# Altium schematic sheet ATMEGA16.SchDoc
size A4
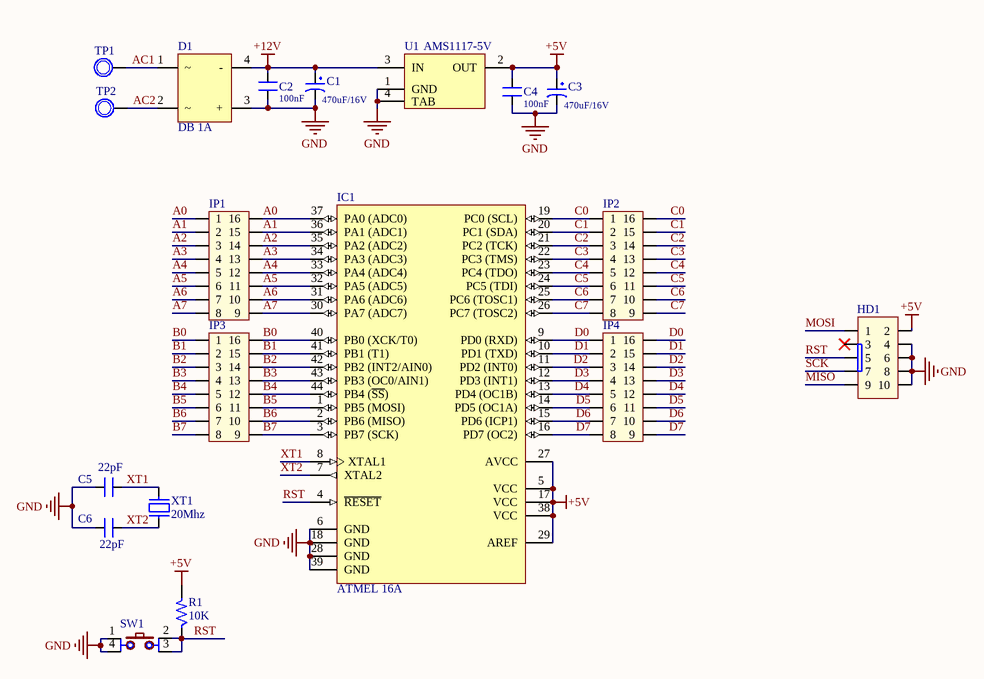
[diagram p0: ATMEGA16.SchDoc]

## Parts
C1  470uF/16V  [C-TANT-7343]
C2  100nF  [CER-0805]
C3  470uF/16V  [C-TANT-7343]
C4  100nF  [CER-0805]
C5  22pF  [CER-0805]
C6  22pF  [CER-0805]
D1  DB 1A  [D-DB-1A-SMD]
HD1  Header 5x2  [Hed2X5]  (value not drawn)
IC1  ATMEL 16A  [TQFP44]
IP1  JP8X2  [JP8X2]  (value not drawn)
IP2  JP8X2  [JP8X2]  (value not drawn)
IP3  JP8X2  [JP8X2]  (value not drawn)
IP4  JP8X2  [JP8X2]  (value not drawn)
R1  10K  [RES-0805]
SW1  SW  [SW2-SMD]  (value not drawn)
TP1  TP  [TP]  (value not drawn)
TP2  TP  [TP]  (value not drawn)
U1  AMS1117-5V  [LM1117]
XT1  20Mhz  [XTAL-RU49/4]

## Nets
+5V: C3.1 C4.2 HD1.2 IC1.5(VCC) IC1.17(VCC) IC1.27(AVCC) IC1.29(AREF) IC1.38(VCC) R1.2 U1.2(OUT)
+12V: C1.1 C2.2 D1.4(-) U1.3(IN)
GND: C1.2 C2.1 C3.2 C4.1 C5.1 C6.1 D1.3(+) HD1.4 HD1.6 HD1.8 HD1.10 IC1.6(GND) IC1.18(GND) IC1.28(GND) IC1.39(GND) SW1.1 SW1.4 U1.1(GND) U1.4(TAB)
A0: IC1.37(PA0_(ADC0)) IP1.1 IP1.16
A1: IC1.36(PA1_(ADC1)) IP1.2 IP1.15
A2: IC1.35(PA2_(ADC2)) IP1.3 IP1.14
A3: IC1.34(PA3_(ADC3)) IP1.4 IP1.13
A4: IC1.33(PA4_(ADC4)) IP1.5 IP1.12
A5: IC1.32(PA5_(ADC5)) IP1.6 IP1.11
A6: IC1.31(PA6_(ADC6)) IP1.7 IP1.10
A7: IC1.30(PA7_(ADC7)) IP1.8 IP1.9
AC1: D1.1 TP1.1
AC2: D1.2 TP2.1
B0: IC1.40(PB0_(XCK/T0)) IP3.1 IP3.16
B1: IC1.41(PB1_(T1)) IP3.2 IP3.15
B2: IC1.42(PB2_(INT2/AIN0)) IP3.3 IP3.14
B3: IC1.43(PB3_(OC0/AIN1)) IP3.4 IP3.13
B4: IC1.44(PB4_(~{SS})) IP3.5 IP3.12
B5: IC1.1(PB5_(MOSI)) IP3.6 IP3.11
B6: IC1.2(PB6_(MISO)) IP3.7 IP3.10
B7: IC1.3(PB7_(SCK)) IP3.8 IP3.9
C0: IC1.19(PC0_(SCL)) IP2.1 IP2.16
C1: IC1.20(PC1_(SDA)) IP2.2 IP2.15
C2: IC1.21(PC2_(TCK)) IP2.3 IP2.14
C3: IC1.22(PC3_(TMS)) IP2.4 IP2.13
C4: IC1.23(PC4_(TDO)) IP2.5 IP2.12
C5: IC1.24(PC5_(TDI)) IP2.6 IP2.11
C6: IC1.25(PC6_(TOSC1)) IP2.7 IP2.10
C7: IC1.26(PC7_(TOSC2)) IP2.8 IP2.9
D0: IC1.9(PD0_(RXD)) IP4.1 IP4.16
D1: IC1.10(PD1_(TXD)) IP4.2 IP4.15
D2: IC1.11(PD2_(INT0)) IP4.3 IP4.14
D3: IC1.12(PD3_(INT1)) IP4.4 IP4.13
D4: IC1.13(PD4_(OC1B)) IP4.5 IP4.12
D5: IC1.14(PD5_(OC1A)) IP4.6 IP4.11
D6: IC1.15(PD6_(ICP1)) IP4.7 IP4.10
D7: IC1.16(PD7_(OC2)) IP4.8 IP4.9
MISO: HD1.9
MOSI: HD1.1
RST: HD1.5 IC1.4(~{RESET}) R1.1 SW1.2 SW1.3
SCK: HD1.7
XT1: C5.2 IC1.8(XTAL1) XT1.2
XT2: C6.2 IC1.7(XTAL2) XT1.1

Not connected (* = marked no-connect by the designer): HD1 3*

## Library data of the parts
C1 C3 = Capacitor
C2 C4-C6 = Ceramic
D1 = DB
HD1 = HED5x2_S: Value: Header 5x2
IC1 = ATmega16A-AU: 8-bit AVR Microcontroller, 16KB Flash, 512 Bytes EEPROM, 1KB SRAM, 44-pin TQFP, Industrial Grade (-40°C to 85°C); Value: Atmega 16L
R1 = Res1/4W
SW1 = SW4: Switch button 4 pin; Value: Button chip 4 pin
U1 = LM1117IMP-3.3: 800mA Low-Dropout Linear Regulator; Manufacturer: National Semiconductor; CompType: LDO IC; PackageTopMarking: XYTT*N05B; PowerWise: N; Published: 4-Dec-2008; DatasheetVersion: Apr-2006; PackageVersion: revB, Apr-2003; PackageReference: MP04A; Publisher: Altium Limited; PackageDescription: Molded SOT-223, 6.50 x 3.56 x 1.6mm Body, 4 Lead, 2.3mm Pitch; PartNumber: LM1117IMP-3.3; RoHS: O; PinCount: 4; DigiKeyPartNumber: LM1117IMP-3.3CT-ND; Code_JEDEC: TO-261-AA; Code_IPC: SOT223-4; ComponentLink1Description: LM1117 Datasheet; ComponentLink1URL: http://www.national.com/ds/LM/LM1117.pdf; ComponentLink2Description: LM1117 Web Page; ComponentLink2URL: http://www.national.com/pf/LM/LM1117.html; ComponentLink3Description: MP04A Package Page; ComponentLink3URL: http://www.national.com/packaging/folders/mp04a.html
XT1 = XT2: Crystal, 32.768 KHz, -40 to 85 degC, 3.2 x 1.5 x 0.9 mm SMD; Value: 4Mhz